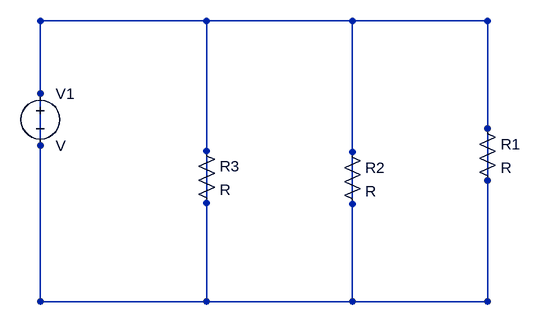
[diagram p0: schematic C4_D2_P1.jpg.asc]
C4_D2_P1.jpg.asc, the LTspice schematic file:
Version 4
SHEET 1 880 680
SYMBOL res 1008 630 R0
SYMATTR InstName R1
SYMBOL res 800 666 R0
SYMATTR InstName R2
SYMBOL res 576 664 R0
SYMATTR InstName R3
SYMBOL voltage 336 576 R0
SYMATTR InstName V1
WIRE 336 480 592 480
WIRE 592 480 816 480
WIRE 592 480 1024 480
WIRE 592 480 592 912
WIRE 336 480 336 912
WIRE 336 912 1024 912
WIRE 336 912 816 912
WIRE 336 912 592 912
WIRE 336 480 816 480
WIRE 336 480 1024 480
WIRE 816 480 1024 480
WIRE 816 480 816 912
WIRE 1024 480 1024 912
WIRE 816 912 1024 912
WIRE 592 912 1024 912
WIRE 592 912 816 912

The netlist it stands for:
* C4_D2_P1.jpg.asc
R1 N001 N001 R
R2 N001 N001 R
R3 N001 N001 R
V1 N001 N001 V
.backanno
.end